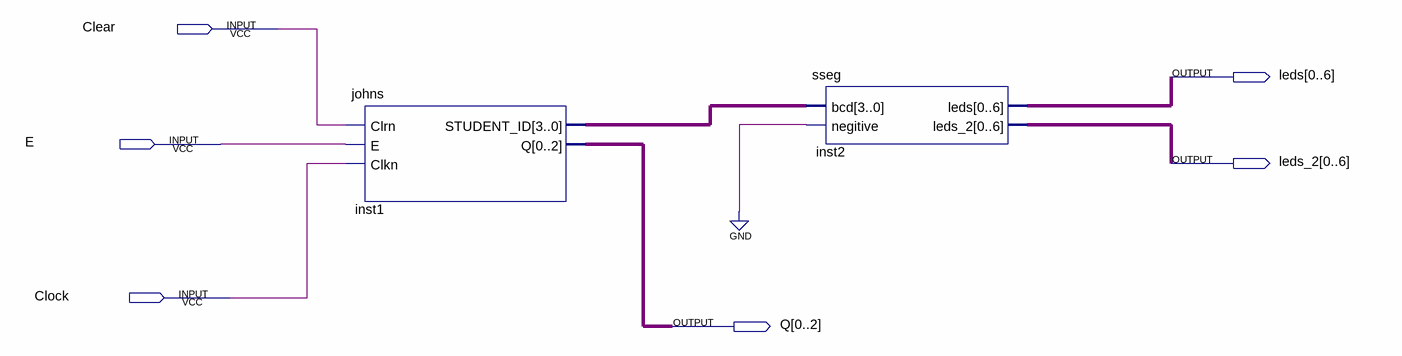
[diagram p0: schematic sheet]
// Quartus schematic final.bdf as structural Verilog: 2 symbols, 6 pins
module \final  (
  input  Clear,
  input  E,
  input  Clock,
  output [0:6] leds,
  output [0:6] leds_2,
  output [0:2] Q
);

  wire [3:0] inst1_student_id;

  johns inst1 (.Clrn(Clear), .E(E), .Clkn(Clock), .STUDENT_ID(inst1_student_id), .Q(Q));
  sseg inst2 (.bcd(inst1_student_id), .negitive(1'b0), .leds(leds), .leds_2(leds_2));
endmodule
